# Altium schematic sheet EnergyHarvester.SchDoc: Energy Harvester
size A4; DocumentNumber: 4; Revision: 0v1; SheetNumber: 4; SheetTotal: 9
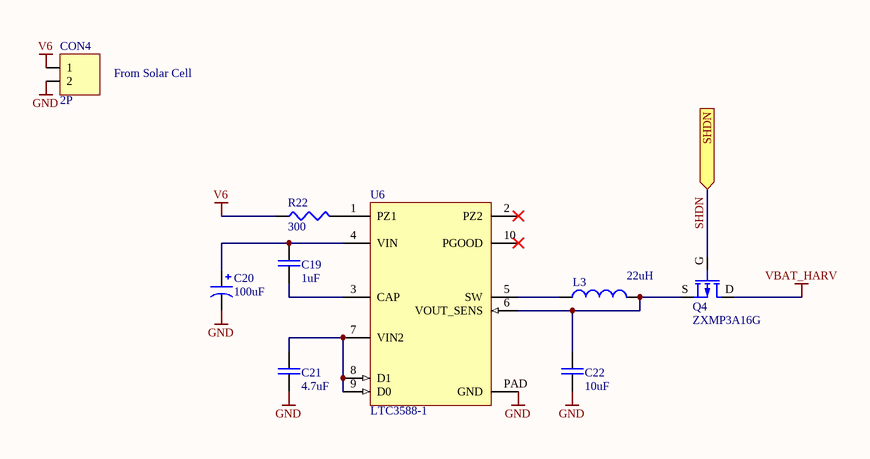
[diagram p0: EnergyHarvester.SchDoc]

## Parts
C19  1uF  [0805]
C20  100uF  [RADIAL-5MM]
C21  4.7uF  [0805]
C22  10uF  [0805]
CON4  2P  [INTERLOCK2-5MM-FIXED]
L3  22uH  [7X7]
Q4  ZXMP3A16G  [SOT-223@GDSD]
R22  300  [0805]
U6  LTC3588-1  [MSOP10@EP]

## Ports
SHDN (in)

## Nets
GND: C20.2(N) C21.1 C22.1 CON4.2 U6.PAD(GND)
V6: CON4.1 R22.1
VBAT_HARV: Q4.D
SHDN: Q4.G ; port SHDN
NetC19_1: C19.1 U6.3(CAP)
NetC19_2: C19.2 C20.1(P) U6.4(VIN)
NetC21_2: C21.2 U6.7(VIN2) U6.8(D1) U6.9(D0)
NetC22_2: C22.2 L3.2 Q4.S U6.6(VOUT_SENS)
NetL3_1: L3.1 U6.5(SW)
NetR22_2: R22.2 U6.1(PZ1)

Not connected (* = marked no-connect by the designer): U6 2(PZ2)* 10(PGOOD)*

## Notes on the sheet
- From Solar Cell
- Title
- Size:
- Date:
- A4
- Number:
- Time:
- Revision:
- Sheet
- of
- File:

## Library data of the parts
C19 C21 C22 = CAP: Capacitor; Owner: Nuno Brum; Sub-Type: Ceramic; Assembly: INS; Maximum Voltage: *; Creation Date: 2005-04-28; Status: Valid; Validation date: 2006-05-15; Type: Capacitor
C20 = CAP POL: Polarized Capacitor; Owner: Nuno Brum; Sub-Type: Tantalum; Assembly: INS; Validation date: 2006-05-15; Creation Date: 2005-04-28; Status: Valid; Type: Capacitor
CON4 = CON02: Connector 2 pins; Owner: Rui Rebelo; Assembly: INS; Sub-Type: Connector; Creation Date: 2005-05-27; Status: Valid; Validation Date: 2006-05-15; Type: Electrical & Mechanical
L3 = IND: Inductor; Owner: Nuno Brum; Sub-Type: Generic; Assembly: INS; Validation date: 2006-05-15; Creation Date: 2002-07-17; Status: Valid; Type: Inductor
Q4 = MOSFET-P: P-Channel Logic Level Enhancement Mode Field Effect Transistor; Owner: Nuno Brum; Sub-Type: MOSFET; Assembly: INS; Validation date: 2006-05-15; Creation Date: 2001-06-05; Status: Valid; Model: ZXMP3A16G; Type: Transistor
R22 = RES: Resistor; Owner: Nuno Brum; Sub-Type: Generic; Assembly: INS; Validation date: 2006-05-15; Creation Date: 2002-07-17; Status: Valid; Power: *; Type: Resistor
U6 = LTC3588-1: Energy harvester; Type: IC; Creation Date: 2012-03-06